# EasyEDA schematic SCH.json
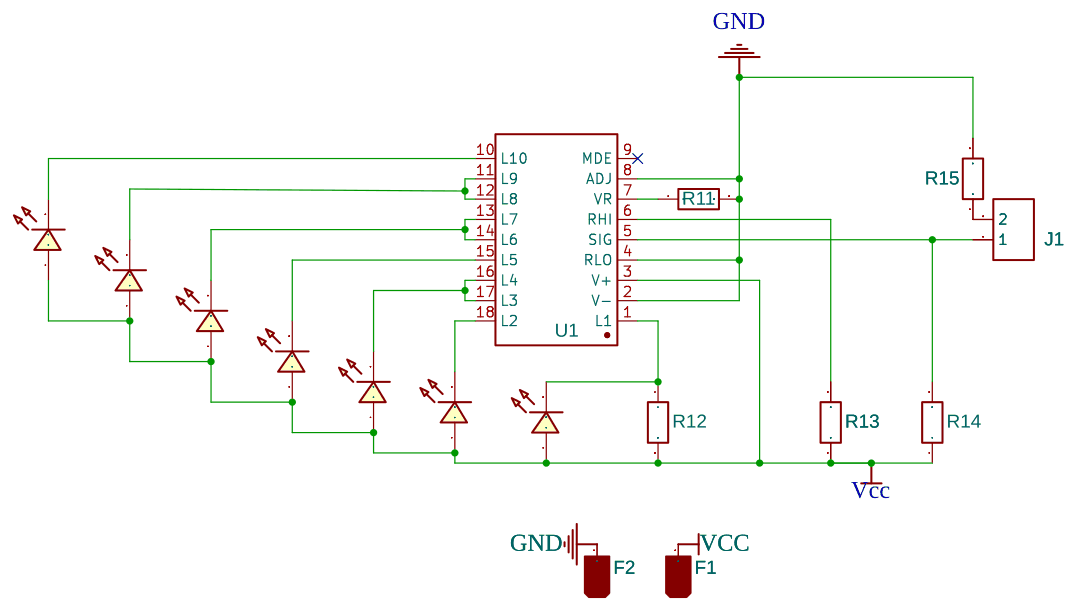
[diagram p0: schematic sheet]

## Parts
F1  FASTON-PCB-6.3X0.8  [PKG-FASTON-PCB-6.3X0.8]
F2  FASTON-PCB-6.3X0.8  [PKG-FASTON-PCB-6.3X0.8]
J1  HDR-M-2.54_1x2  [HDR-M-2.54_1X2]
LED11  LED-TH-5mm_R  [LED-TH_BD5.0_RED]
LED12  LED-TH-3mm_R  [LED-TH_BD3.0_RED]
LED13  LED-TH-3mm_G  [LED-TH_BD3.0_GREEN]
LED14  LED-TH-3mm_G  [LED-TH_BD3.0_GREEN]
LED15  LED-TH-3mm_G  [LED-TH_BD3.0_GREEN]
LED16  LED-TH-3mm_G  [LED-TH_BD3.0_GREEN]
LED17  LED-TH-3mm_G  [LED-TH_BD3.0_GREEN]
R11  1K  [R_AXIAL-0.3]
R12  4k7  [R_AXIAL-0.3]
R13  33k  [R_AXIAL-0.3]
R14  680  [R_AXIAL-0.5]
R15  15  [R_AXIAL-0.5]
U1  LM3914N-1/NOPB  [DIP-18_L23.0-W6.5-P2.54-LS7.6-BL]

## Library data of the parts
F1 F2 = FASTON-PCB-6.3X0.8: Supplier Part: 1772662; Supplier: Element14; Local_Supplier Part: MF754; Local_Supplier: Grazia Componenti; Manufacturer: AMP - TE CONNECTIVITY; Manufacturer Part: 63849-1; link: https://www.farnell.com/cad/1922435.pdf?_ga=2.67784338.2047289426.1582030123-1049137266.1580307456&_gac=1.170723988.1580915791.EAIaIQobChMIifzpoNq65wIVTaqaCh3upgbxEAAYASAAEgJM9PD_BwE; Contributor: Prof. Ing. F. Scordino
J1 = HDR-M-2.54_1x2: Supplier Part: C124375; Supplier: LCSC; Contributor: LCEDA_Lib
LED11 = LED-TH-5mm_R: Manufacturer: EVERLIGHT(台湾亿光); Manufacturer Part: 333-2SURD/S530-A3; Supplier Part: C87271; Supplier: LCSC; Contributor: LCEDA_Lib
LED12 = LED-TH-3mm_R: Manufacturer: EVERLIGHT(台湾亿光); Manufacturer Part: 204-10SDRD/S530-A3-L; Supplier Part: C84774; Supplier: LCSC; Contributor: LCEDA_Lib
LED13-LED17 = LED-TH-3mm_G: Manufacturer: EVERLIGHT(台湾亿光); Manufacturer Part: 204-10SYGD/S530-E3; Supplier Part: C85161; Contributor: LCEDA_Lib
R11-R13 = R_AXIAL-0.4_EU: Contributor: LCEDA_Lib
R14 R15 = R_AXIAL-0.3_EU: Contributor: LCEDA_Lib
U1 = LM3914N-1/NOPB: Supplier: LCSC; Manufacturer: TI; Supplier Part: C9408; JLCPCB Part Class: Extended Part

## Nets
GND: F2.1 R11.2 R15.2 U1.2(V-) U1.4(RLO) U1.8(ADJ)
Vcc: LED11.1 LED12.1 LED13.1 LED14.1 LED15.1 LED16.1 LED17.1 R12.2 R13.1 R14.1 U1.3(V+)
VCC: F1.1
Net-(J1-1): J1.1 R14.2 U1.5(SIG)
Net-(J1-2): J1.2 R15.1
Net-(LED11-2): LED11.2 R12.1 U1.1(L1)
Net-(LED12-2): LED12.2 U1.18(L2)
Net-(LED13-2): LED13.2 U1.16(L4) U1.17(L3)
Net-(LED14-2): LED14.2 U1.15(L5)
Net-(LED15-2): LED15.2 U1.13(L7) U1.14(L6)
Net-(LED16-2): LED16.2 U1.11(L9) U1.12(L8)
Net-(LED17-2): LED17.2 U1.10(L10)
Net-(R11-1): R11.1 U1.7(VR)
Net-(R13-2): R13.2 U1.6(RHI)

Not connected (* = marked no-connect by the designer): U1 9(MDE)*
